# Altium project CAN Breakout.PrjPcb
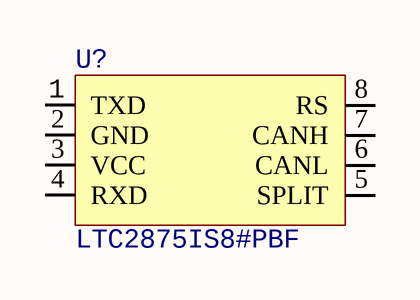
[diagram p0: CAN Breakout.SchDoc]
1 sheet, 1 parts. Net scope: global (net labels, ports and power ports of the same name join across sheets).
Board file: CAN Breakout.PcbDoc

## Sheet CAN Breakout.SchDoc: CAN Breakout
size Letter; Revision: 1; SheetNumber: 1; SheetTotal: 1

### Parts
U?  MPN: LTC2875IS8#PBF  [LT-S8_N]  (hidden comment: IC TXRX CAN)

### Nets

Not connected (* = marked no-connect by the designer): U? 1(TXD) 2(GND) 3(VCC) 4(RXD) 5(SPLIT) 6(CANL) 7(CANH) 8(RS)

### Notes on the sheet
- Title
- Size:
- Date:
- Letter
- Drawn By:
- Sheet
- of
- File:

### Library data of the parts
U? = LTC2875: IC TXRX CAN 4MBPS 8SO; Manufacturer: Linear Technologies; Package: 8-SOIC (0.154", 3.90mm Width); ComponentLink1Description: Datasheet; ComponentLink1URL: https://www.analog.com/media/en/technical-documentation/data-sheets/2875f.pdf; Supplier Part Number 1: LTC2875IS8#PBF-ND; Supplier 1: Digi-Key